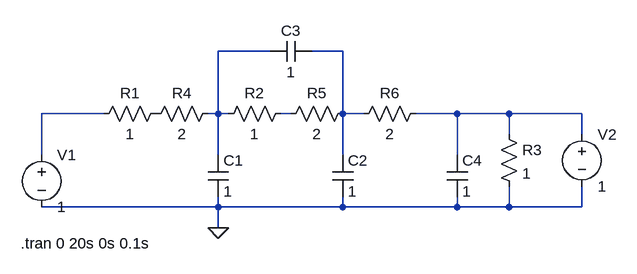
[diagram p0: schematic P1.asc]
P1.asc, the LTspice schematic file:
Version 4
SHEET 1 880 680
WIRE 192 -128 112 -128
WIRE 304 -128 256 -128
WIRE -64 -32 -160 -32
WIRE 112 -32 112 -128
WIRE 112 -32 96 -32
WIRE 128 -32 112 -32
WIRE 224 -32 208 -32
WIRE 304 -32 304 -128
WIRE 336 -32 304 -32
WIRE 480 -32 416 -32
WIRE 560 -32 480 -32
WIRE 672 -32 560 -32
WIRE 560 0 560 -32
WIRE 672 0 672 -32
WIRE -160 32 -160 -32
WIRE 112 32 112 -32
WIRE 304 32 304 -32
WIRE 480 32 480 -32
WIRE 112 112 112 96
WIRE 112 112 -160 112
WIRE 304 112 304 96
WIRE 304 112 112 112
WIRE 480 112 480 96
WIRE 480 112 304 112
WIRE 560 112 560 80
WIRE 560 112 480 112
WIRE 672 112 672 80
WIRE 672 112 560 112
WIRE 112 144 112 112
FLAG 112 144 0
SYMBOL cap 96 32 R0
SYMATTR InstName C1
SYMATTR Value 1
SYMBOL res 32 -48 R90
WINDOW 0 0 56 VBottom 2
WINDOW 3 32 56 VTop 2
SYMATTR InstName R1
SYMATTR Value 1
SYMBOL res 224 -48 R90
WINDOW 0 0 56 VBottom 2
WINDOW 3 32 56 VTop 2
SYMATTR InstName R2
SYMATTR Value 1
SYMBOL res 544 -16 R0
SYMATTR InstName R3
SYMATTR Value 1
SYMBOL cap 288 32 R0
SYMATTR InstName C2
SYMATTR Value 1
SYMBOL cap 256 -144 R90
WINDOW 0 0 32 VBottom 2
WINDOW 3 32 32 VTop 2
SYMATTR InstName C3
SYMATTR Value 1
SYMBOL cap 464 32 R0
SYMATTR InstName C4
SYMATTR Value 1
SYMBOL res 112 -48 R90
WINDOW 0 0 56 VBottom 2
WINDOW 3 32 56 VTop 2
SYMATTR InstName R4
SYMATTR Value 2
SYMBOL res 320 -48 R90
WINDOW 0 0 56 VBottom 2
WINDOW 3 32 56 VTop 2
SYMATTR InstName R5
SYMATTR Value 2
SYMBOL res 432 -48 R90
WINDOW 0 0 56 VBottom 2
WINDOW 3 32 56 VTop 2
SYMATTR InstName R6
SYMATTR Value 2
SYMBOL voltage -160 16 R0
WINDOW 123 0 0 Left 0
WINDOW 39 0 0 Left 0
SYMATTR InstName V1
SYMATTR Value 1
SYMBOL voltage 672 -16 R0
WINDOW 123 0 0 Left 0
WINDOW 39 0 0 Left 0
SYMATTR InstName V2
SYMATTR Value 1
TEXT -192 168 Left 2 !.tran 0 20s 0s 0.1s

The netlist it stands for:
* P1.asc
C1 N001 0 1
R1 P001 N003 1
R2 N004 N001 1
R3 N005 0 1
C2 N002 0 1
C3 N002 N001 1
C4 N005 0 1
R4 N001 P001 2
R5 N002 N004 2
R6 N005 N002 2
V1 N003 0 1
V2 N005 0 1
.tran 0 20s 0s 0.1s
.backanno
.end